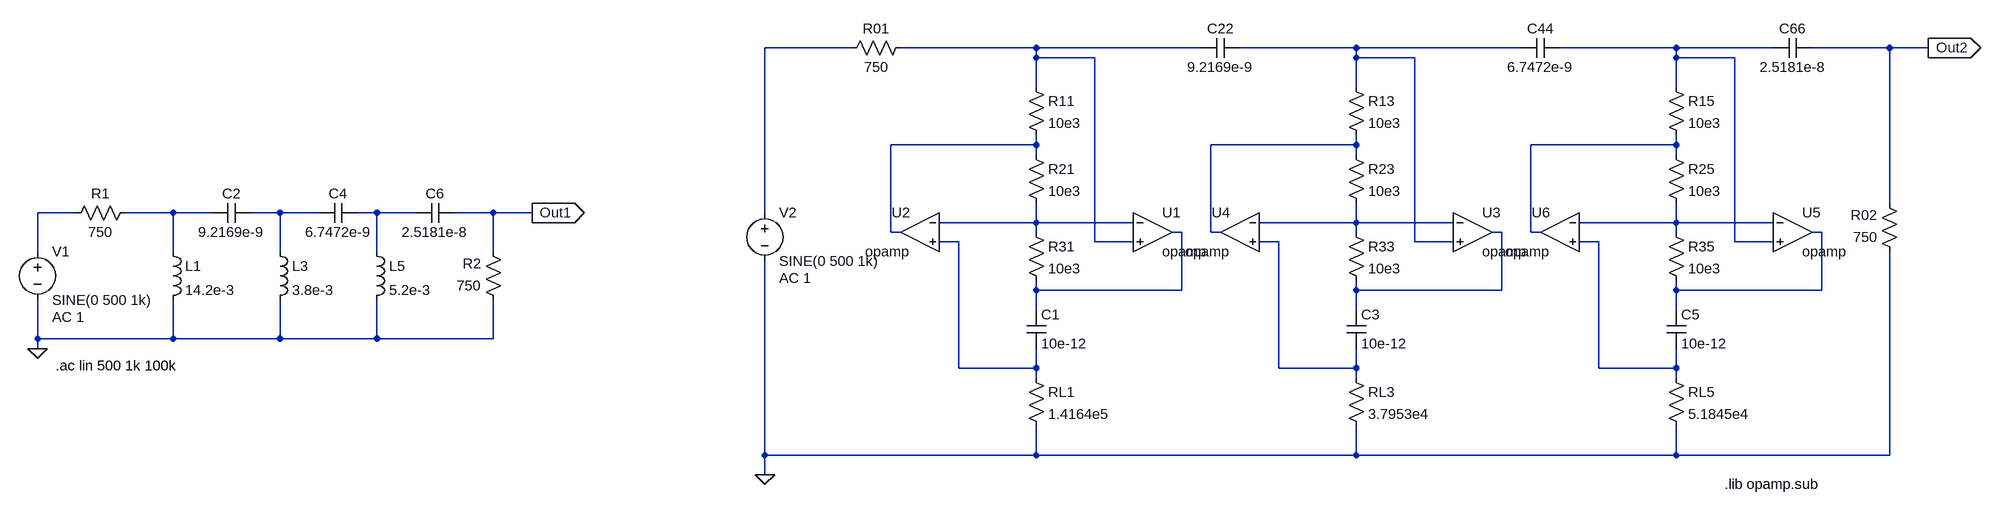
[diagram p0: schematic trabalho 2 sintese.asc]
trabalho 2 sintese.asc, the LTspice schematic file:
Version 4
SHEET 1 3284 680
WIRE 1392 -192 1248 -192
WIRE 1696 -192 1472 -192
WIRE 1968 -192 1696 -192
WIRE 2224 -192 2032 -192
WIRE 2496 -192 2224 -192
WIRE 2752 -192 2560 -192
WIRE 2912 -192 2752 -192
WIRE 3104 -192 2976 -192
WIRE 3168 -192 3104 -192
WIRE 1696 -176 1696 -192
WIRE 1792 -176 1696 -176
WIRE 2224 -176 2224 -192
WIRE 2320 -176 2224 -176
WIRE 2752 -176 2752 -192
WIRE 2848 -176 2752 -176
WIRE 1696 -128 1696 -176
WIRE 2224 -128 2224 -176
WIRE 2752 -128 2752 -176
WIRE 1696 -32 1696 -48
WIRE 1696 -32 1456 -32
WIRE 2224 -32 2224 -48
WIRE 2224 -32 1984 -32
WIRE 2752 -32 2752 -48
WIRE 2752 -32 2512 -32
WIRE 1696 -16 1696 -32
WIRE 2224 -16 2224 -32
WIRE 2752 -16 2752 -32
WIRE 3104 64 3104 -192
WIRE 112 80 48 80
WIRE 272 80 192 80
WIRE 336 80 272 80
WIRE 448 80 400 80
WIRE 512 80 448 80
WIRE 608 80 576 80
WIRE 672 80 608 80
WIRE 800 80 736 80
WIRE 864 80 800 80
WIRE 1248 80 1248 -192
WIRE 1696 96 1696 64
WIRE 1696 96 1536 96
WIRE 1856 96 1696 96
WIRE 2224 96 2224 64
WIRE 2224 96 2064 96
WIRE 2384 96 2224 96
WIRE 2752 96 2752 64
WIRE 2752 96 2592 96
WIRE 2912 96 2752 96
WIRE 1456 112 1456 -32
WIRE 1472 112 1456 112
WIRE 1696 112 1696 96
WIRE 1936 112 1920 112
WIRE 1984 112 1984 -32
WIRE 2000 112 1984 112
WIRE 2224 112 2224 96
WIRE 2464 112 2448 112
WIRE 2512 112 2512 -32
WIRE 2528 112 2512 112
WIRE 2752 112 2752 96
WIRE 2992 112 2976 112
WIRE 1568 128 1536 128
WIRE 1792 128 1792 -176
WIRE 1856 128 1792 128
WIRE 2096 128 2064 128
WIRE 2320 128 2320 -176
WIRE 2384 128 2320 128
WIRE 2624 128 2592 128
WIRE 2848 128 2848 -176
WIRE 2912 128 2848 128
WIRE 48 144 48 80
WIRE 272 144 272 80
WIRE 448 144 448 80
WIRE 608 144 608 80
WIRE 800 144 800 80
WIRE 1696 208 1696 192
WIRE 1936 208 1936 112
WIRE 1936 208 1696 208
WIRE 2224 208 2224 192
WIRE 2464 208 2464 112
WIRE 2464 208 2224 208
WIRE 2752 208 2752 192
WIRE 2992 208 2992 112
WIRE 2992 208 2752 208
WIRE 1696 240 1696 208
WIRE 2224 240 2224 208
WIRE 2752 240 2752 208
WIRE 48 288 48 224
WIRE 272 288 272 224
WIRE 272 288 48 288
WIRE 448 288 448 224
WIRE 448 288 272 288
WIRE 608 288 608 224
WIRE 608 288 448 288
WIRE 800 288 800 224
WIRE 800 288 608 288
WIRE 48 304 48 288
WIRE 1568 336 1568 128
WIRE 1696 336 1696 304
WIRE 1696 336 1568 336
WIRE 2096 336 2096 128
WIRE 2224 336 2224 304
WIRE 2224 336 2096 336
WIRE 2624 336 2624 128
WIRE 2752 336 2752 304
WIRE 2752 336 2624 336
WIRE 1696 352 1696 336
WIRE 2224 352 2224 336
WIRE 2752 352 2752 336
WIRE 1248 480 1248 160
WIRE 1696 480 1696 432
WIRE 1696 480 1248 480
WIRE 2224 480 2224 432
WIRE 2224 480 1696 480
WIRE 2752 480 2752 432
WIRE 2752 480 2224 480
WIRE 3104 480 3104 144
WIRE 3104 480 2752 480
WIRE 1248 512 1248 480
FLAG 48 304 0
FLAG 1248 512 0
FLAG 864 80 Out1
IOPIN 864 80 Out
FLAG 3168 -192 Out2
IOPIN 3168 -192 Out
SYMBOL voltage 48 128 R0
WINDOW 123 24 124 Left 2
WINDOW 39 0 0 Left 0
SYMATTR InstName V1
SYMATTR Value SINE(0 500 1k)
SYMATTR Value2 AC 1
SYMBOL res 208 64 R90
WINDOW 0 0 56 VBottom 2
WINDOW 3 32 56 VTop 2
SYMATTR InstName R1
SYMATTR Value 750
SYMBOL res 816 240 R180
WINDOW 0 36 76 Left 2
WINDOW 3 36 40 Left 2
SYMATTR InstName R2
SYMATTR Value 750
SYMBOL ind 256 128 R0
SYMATTR InstName L1
SYMATTR Value 14.2e-3
SYMBOL ind 432 128 R0
SYMATTR InstName L3
SYMATTR Value 3.8e-3
SYMBOL ind 592 128 R0
SYMATTR InstName L5
SYMATTR Value 5.2e-3
SYMBOL cap 400 64 R90
WINDOW 0 0 32 VBottom 2
WINDOW 3 32 32 VTop 2
SYMATTR InstName C2
SYMATTR Value 9.2169e-9
SYMBOL cap 576 64 R90
WINDOW 0 0 32 VBottom 2
WINDOW 3 32 32 VTop 2
SYMATTR InstName C4
SYMATTR Value 6.7472e-9
SYMBOL cap 736 64 R90
WINDOW 0 0 32 VBottom 2
WINDOW 3 32 32 VTop 2
SYMATTR InstName C6
SYMATTR Value 2.5181e-8
SYMBOL res 1680 -144 R0
SYMATTR InstName R11
SYMATTR Value 10e3
SYMBOL res 1680 -32 R0
SYMATTR InstName R21
SYMATTR Value 10e3
SYMBOL res 1680 96 R0
SYMATTR InstName R31
SYMATTR Value 10e3
SYMBOL cap 1680 240 R0
SYMATTR InstName C1
SYMATTR Value 10e-12
SYMBOL res 1680 336 R0
SYMATTR InstName RL1
SYMATTR Value 1.4164e5
SYMBOL OpAmps\\opamp 1888 48 R0
SYMATTR InstName U1
SYMATTR SpiceLine Aol=100G
SYMATTR SpiceLine2 GBW=100G
SYMBOL OpAmps\\opamp 1504 48 M0
SYMATTR InstName U2
SYMATTR SpiceLine Aol=100G
SYMATTR SpiceLine2 GBW=100G
SYMBOL res 2208 -144 R0
SYMATTR InstName R13
SYMATTR Value 10e3
SYMBOL res 2208 -32 R0
SYMATTR InstName R23
SYMATTR Value 10e3
SYMBOL res 2208 96 R0
SYMATTR InstName R33
SYMATTR Value 10e3
SYMBOL cap 2208 240 R0
SYMATTR InstName C3
SYMATTR Value 10e-12
SYMBOL res 2208 336 R0
SYMATTR InstName RL3
SYMATTR Value 3.7953e4
SYMBOL OpAmps\\opamp 2416 48 R0
SYMATTR InstName U3
SYMATTR SpiceLine Aol=100G
SYMATTR SpiceLine2 GBW=100G
SYMBOL OpAmps\\opamp 2032 48 M0
SYMATTR InstName U4
SYMATTR SpiceLine Aol=100G
SYMATTR SpiceLine2 GBW=100G
SYMBOL res 2736 -144 R0
SYMATTR InstName R15
SYMATTR Value 10e3
SYMBOL res 2736 -32 R0
SYMATTR InstName R25
SYMATTR Value 10e3
SYMBOL res 2736 96 R0
SYMATTR InstName R35
SYMATTR Value 10e3
SYMBOL cap 2736 240 R0
SYMATTR InstName C5
SYMATTR Value 10e-12
SYMBOL res 2736 336 R0
SYMATTR InstName RL5
SYMATTR Value 5.1845e4
SYMBOL OpAmps\\opamp 2944 48 R0
SYMATTR InstName U5
SYMATTR SpiceLine Aol=100G
SYMATTR SpiceLine2 GBW=100G
SYMBOL OpAmps\\opamp 2560 48 M0
SYMATTR InstName U6
SYMATTR SpiceLine Aol=100G
SYMATTR SpiceLine2 GBW=100G
SYMBOL voltage 1248 64 R0
WINDOW 123 24 124 Left 2
WINDOW 39 0 0 Left 0
SYMATTR InstName V2
SYMATTR Value SINE(0 500 1k)
SYMATTR Value2 AC 1
SYMBOL res 1488 -208 R90
WINDOW 0 0 56 VBottom 2
WINDOW 3 32 56 VTop 2
SYMATTR InstName R01
SYMATTR Value 750
SYMBOL res 3120 160 R180
WINDOW 0 36 76 Left 2
WINDOW 3 36 40 Left 2
SYMATTR InstName R02
SYMATTR Value 750
SYMBOL cap 2032 -208 R90
WINDOW 0 0 32 VBottom 2
WINDOW 3 32 32 VTop 2
SYMATTR InstName C22
SYMATTR Value 9.2169e-9
SYMBOL cap 2560 -208 R90
WINDOW 0 0 32 VBottom 2
WINDOW 3 32 32 VTop 2
SYMATTR InstName C44
SYMATTR Value 6.7472e-9
SYMBOL cap 2976 -208 R90
WINDOW 0 0 32 VBottom 2
WINDOW 3 32 32 VTop 2
SYMATTR InstName C66
SYMATTR Value 2.5181e-8
TEXT 2832 528 Left 2 !.lib opamp.sub
TEXT 78 332 Left 2 !.ac lin 500 1k 100k

The netlist it stands for:
* trabalho 2 sintese.asc
V1 N008 0 SINE(0 500 1k) AC 1
R1 N009 N008 750
R2 0 Out1 750
L1 N009 0 14.2e-3
L3 N010 0 3.8e-3
L5 N011 0 5.2e-3
C2 N010 N009 9.2169e-9
C4 N011 N010 6.7472e-9
C6 Out1 N011 2.5181e-8
R11 N002 N005 10e3
R21 N005 N012 10e3
R31 N012 N015 10e3
C1 N015 N018 10e-12
RL1 N018 0 1.4164e5
XU1 N012 N002 N015 opamp Aol=100G GBW=100G  ; pins invin noninvin out
XU2 N012 N018 N005 opamp Aol=100G GBW=100G  ; pins invin noninvin out
R13 N003 N006 10e3
R23 N006 N013 10e3
R33 N013 N016 10e3
C3 N016 N019 10e-12
RL3 N019 0 3.7953e4
XU3 N013 N003 N016 opamp Aol=100G GBW=100G  ; pins invin noninvin out
XU4 N013 N019 N006 opamp Aol=100G GBW=100G  ; pins invin noninvin out
R15 N004 N007 10e3
R25 N007 N014 10e3
R35 N014 N017 10e3
C5 N017 N020 10e-12
RL5 N020 0 5.1845e4
XU5 N014 N004 N017 opamp Aol=100G GBW=100G  ; pins invin noninvin out
XU6 N014 N020 N007 opamp Aol=100G GBW=100G  ; pins invin noninvin out
V2 N001 0 SINE(0 500 1k) AC 1
R01 N002 N001 750
R02 0 Out2 750
C22 N003 N002 9.2169e-9
C44 N004 N003 6.7472e-9
C66 Out2 N004 2.5181e-8
.lib opamp.sub
.ac lin 500 1k 100k
.backanno
.end